# Altium project Nixie Valve Clock Power Supply Daughterboard.PrjPcb
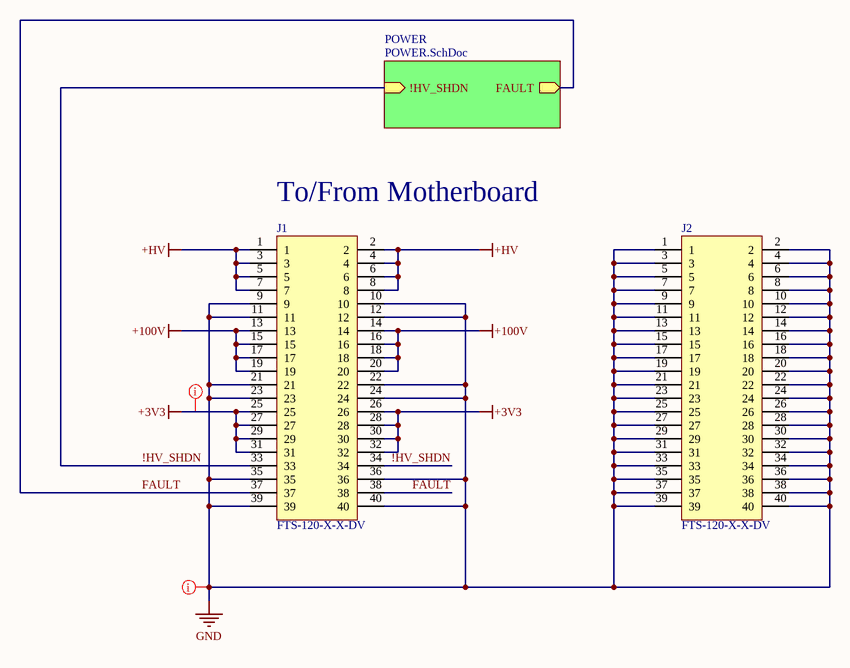
[diagram p0: Nixie Valve Clock Power Supply Daughterboard.SchDoc]
3 sheets, 48 parts. Net scope: hierarchical (ports join the sheet entries above them; power ports are global).
Board file: Nixie Valve Clock Power Supply Daughterboard.PcbDoc
Sheets:
  Nixie Valve Clock Power Supply Daughterboard.SchDoc
    POWER = POWER.SchDoc
      HV = HV.SchDoc

## Sheet Nixie Valve Clock Power Supply Daughterboard.SchDoc
size A4; SheetNumber: 1; SheetTotal: 3

### Parts
(Parts that share a designator on the sheet are numbered #1, #2 ... from top to bottom, then left to right.)
?#1  (no value)
J1  FTS-120-X-X-DV  [SAMTEC_FTS-120-X-X-DV]
J2  FTS-120-X-X-DV  [SAMTEC_FTS-120-X-X-DV]

### Sub-sheets
POWER = POWER.SchDoc: !HV_SHDN (in), FAULT (out)

### Nets
+3V3: J1.25 J1.26 J1.27 J1.28 J1.29 J1.30 J1.31 J1.32
+100V: J1.13 J1.14 J1.15 J1.16 J1.17 J1.18 J1.19 J1.20
+HV: J1.1 J1.2 J1.3 J1.4 J1.5 J1.6 J1.7 J1.8
GND: J1.9 J1.10 J1.11 J1.12 J1.21 J1.22 J1.23 J1.24 J1.35 J1.36 J1.39 J1.40 J2.1 J2.2 J2.3 J2.4 J2.5 J2.6 J2.7 J2.8 J2.9 J2.10 J2.11 J2.12 J2.13 J2.14 J2.15 J2.16 J2.17 J2.18 J2.19 J2.20 J2.21 J2.22 J2.23 J2.24 J2.25 J2.26 J2.27 J2.28 J2.29 J2.30 J2.31 J2.32 J2.33 J2.34 J2.35 J2.36 J2.37 J2.38 J2.39 J2.40
!HV_SHDN: J1.33 J1.34 ; sheet POWER/!HV_SHDN
FAULT: J1.37 J1.38 ; sheet POWER/FAULT

### Layout directives
net class POWER: +3V3, GND

### Notes on the sheet
- (near J1) To/From Motherboard
- Project:
- Designer:
- Sheet
- of
- Filename:

### Library data of the parts
?#1 = CMP-00003-4: The KETS Schematic Sheet Title Block
J1 J2 = CMP-002-00205-3: Pin Header, Board-to-Board, 1.27 mm, 2 Rows, 40 Contacts, Surface Mount, FTS Series; Manufacturer Lifecycle Status: PRODUCTION; Gender: Male; MP: FTS-120-02-L-DV; MF: Samtec; Current Rating: 1.75A; Pitch: 1.27mm; Number of Contacts: 40; Pins: 40; Design Item ID: FTS-120-X-X-DV; Case/Package: None; Mounting Technology: Surface Mount; Check_prices: https://www.snapeda.com/parts/FTS-120-04-G-DV-P/Samtec/view-part/?ref=eda; Source: FTS-120-X-X-DV.SchLib; Value: *; Component Type: Standard; Min Operating Temperature: -55°C; Max Operating Temperature: 125°C; SnapEDA_Link: https://www.snapeda.com/parts/FTS-120-04-G-DV-P/Samtec/view-part/?ref=snap; Termination: Solder; Lifecycle Status: Production; Housing Material: Polymer; Housing Color: Black; Number of Rows: 2; RoHS: Compliant; Contact Material: Bronze; Orientation: Straight; REACH SVHC: No; Depth: 3.42mm; Length: 25.4mm; Contact Plating: Gold

## Sheet POWER.SchDoc
size A4; SheetNumber: 2; SheetTotal: 3
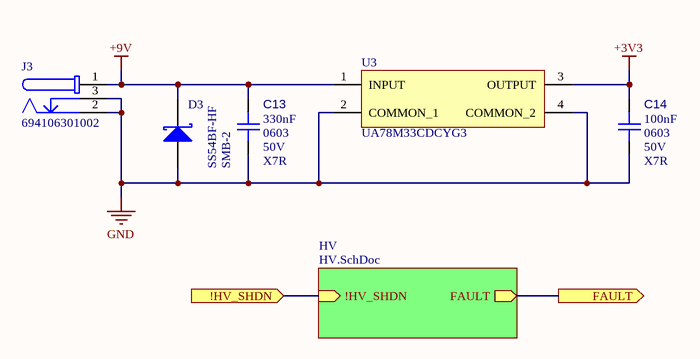
[diagram p1: POWER.SchDoc]

### Parts
(Parts that share a designator on the sheet are numbered #1, #2 ... from top to bottom, then left to right.)
?#2  (no value)
C13  value 330nF  Rated DC Voltage (URdc): 50V  Case/Package: 0603  Dielectric: X7R  [CAPC1608X10N]  (hidden comment: C1608X7R1H334K080AC)
C14  value 100nF  Voltage Rating: 50V  Case/Package: 0603  Dielectric: X7R  [CAPC1608X09N]  (hidden comment: CGA3E2X7R1H104K080AA)
D3  SS54BF-HF  Case/Package: SMB-2  [JCET-SMB-2_N]
J3  694106301002  [694106301002]
U3  UA78M33CDCYG3  [SOT-223-DB3_N]

### Sub-sheets
HV = HV.SchDoc: FAULT (out), !HV_SHDN (in)

### Ports
!HV_SHDN (in), FAULT (out)

### Nets
+3V3: C14.1 U3.3(OUTPUT)
+9V: C13.1 D3.2(K) J3.1 U3.1(INPUT)
GND: C13.2 C14.2 D3.1(A) J3.2 J3.3 U3.2(COMMON_1) U3.4(COMMON_2)
!HV_SHDN: port !HV_SHDN, sheet HV/!HV_SHDN
FAULT: port FAULT, sheet HV/FAULT

### Notes on the sheet
- Project:
- Designer:
- Sheet
- of
- Filename:

### Library data of the parts
?#2 = CMP-00003-4: The KETS Schematic Sheet Title Block
C13 = CMP-001-00114-1: Ceramic Capacitor, Multilayer, Ceramic, 50V, 10% +Tol, 10% -Tol, X7R, 15% TC, 0.33uF, Surface Mount, 0603; Multilayer: Yes; JESD-609 Code: e3; Width: 0.8mm; Voltage Rating: 50V; Tolerance  (fill in as +-): 10%; Packaging: Tape and Reel; Dielectric Material: Ceramic; Capacitor Type: Ceramic; Pins: 2; Package Shape: Rectangular; Reach SVHC Compliant: Yes; Package Style: SMTMeter; Min Operating Temperature: -55°C; Length: 1.6mm; Max Operating Temperature: 125°C; Terminal Finish: Nickel; Tolerance (fill in as +-): 10%; Termination: Wraparound; RoHS Compliant: Yes; Mounting Technology: Surface Mount; Temperature Characteristics Code: X7R; Tolerance: 10%; Height: 0.8mm
C14 = CMP-001-00101-1: Ceramic Capacitor, Multilayer, Ceramic, 50V, 10% +Tol, 10% -Tol, X7R, 15% TC, 0.1uF, Surface Mount, 0603; Reference Standard: AEC-Q200; Multilayer: Yes; Tolerance  (fill in as +-): 10%; Mounting Technology: Surface Mount; Max Operating Temperature: 125°C; Min Operating Temperature: -55°C; Tolerance: 10%; Packaging: Tape and Reel; Length: 1.6mm; Package Style: SMTMeter; Width: 0.8mm; Height: 0.8mm; Pins: 2; Reach SVHC Compliant: Yes; RoHS Compliant: Yes; Package Shape: Rectangular; Tolerance (fill in as +-): 10%; Rated DC Voltage (URdc): 50V; JESD-609 Code: e3; Capacitor Type: Ceramic; Termination: Wraparound; Terminal Finish: Nickel; Dielectric Material: Ceramic; Temperature Characteristics Code: X7R
D3 = CMP-004-00006-3: Rectifier Diode, Schottky, 1 Phase, 1 Element, 5A, 40V V(RRM), Silicon; Manufacturer: JCET; Forward Voltage: 550mV; Peak Reverse Current: 1mA; Max Forward Surge Current (Ifsm): 120A; Number of Elements: 1; Datasheet URL: http://wiki.seeedstudio.com/images/3/3f/0310130P1.pdf; Datasheet Version: May-13; Package Reference: SMB-2; RoHS Compliant: Unknown; Max Operating Temperature: 150°C; Min Operating Temperature: -55°C; Manufacturer URL: http://www.cj-elec.com/; Mounting Technology: SM; Package Description: 2-Pin Surface Mount Device, Body 4.315 x 3.62 mm; Number of Terminals: 2; REACH SVHC: Yes; Lifecycle Status: Production; Reverse Standoff Voltage: 40V; Max Output current: 5A; RoHS: Compliant
J3 = CMP-002-00210-1: DC Power Jack Connector WR-DC, Male, Right Angled, THT, 5 A, 24 V; Max Current Rating: 5A; Shielding: Unshielded; Operating Supply Voltage: 24V; Insulation Resistance: 100MΩ; Number of Contacts: 3; Color: Black; Gender: Male; Mounting Technology: Through Hole; Connector Type: Power; Flammability Rating: UL94 V-0; Housing Material: Polyamide; RoHS Compliant: Yes; Current Rating: 5A; Max Operating Temperature: 85°C; Voltage Rating: 24V; Pins: 3; Min Operating Temperature: -40°C; Contact Plating: Tin; Packaging: Bulk; Contact Gender: Female; REACH SVHC: Unknown; Termination: Through Hole; Height: 11mm; RoHS: Compliant; Contact Material: Gold, Tin
U3 = CMP-00395-1: Standard Regulator Pos 3.3V 0.5A 4-Pin(3+Tab) SOT-223 Tube; Manufacturer Lifecycle Status: ACTIVE; Quiescent Current: 4.5mA; Dropout Voltage: 2V; Power Supply Rejection Ratio (PSRR): 80dB; Polarity: Positive; Number of Outputs: 1; Max Output current: 500mA; Min Input Voltage: 5.3V; Max Supply Voltage: 25V; Output Type: Fixed; Width: 3.5mm; Radiation Hardening: No; Lifecycle Status: Production; Min Operating Temperature: -40°C; Thickness: 1.6mm; Height: 1.8mm; Number of Regulators: 1; Output Current: 500mA; Case/Package: SOT-223; Max Operating Temperature: 125°C; Lead Free: Lead Free; Output Voltage: 3.3V; Length: 6.5mm; Packaging: Rail/Tube; Pins: 4; RoHS: Compliant; Mounting Technology: Surface Mount

## Sheet HV.SchDoc
size A2; SheetNumber: 3; SheetTotal: 3
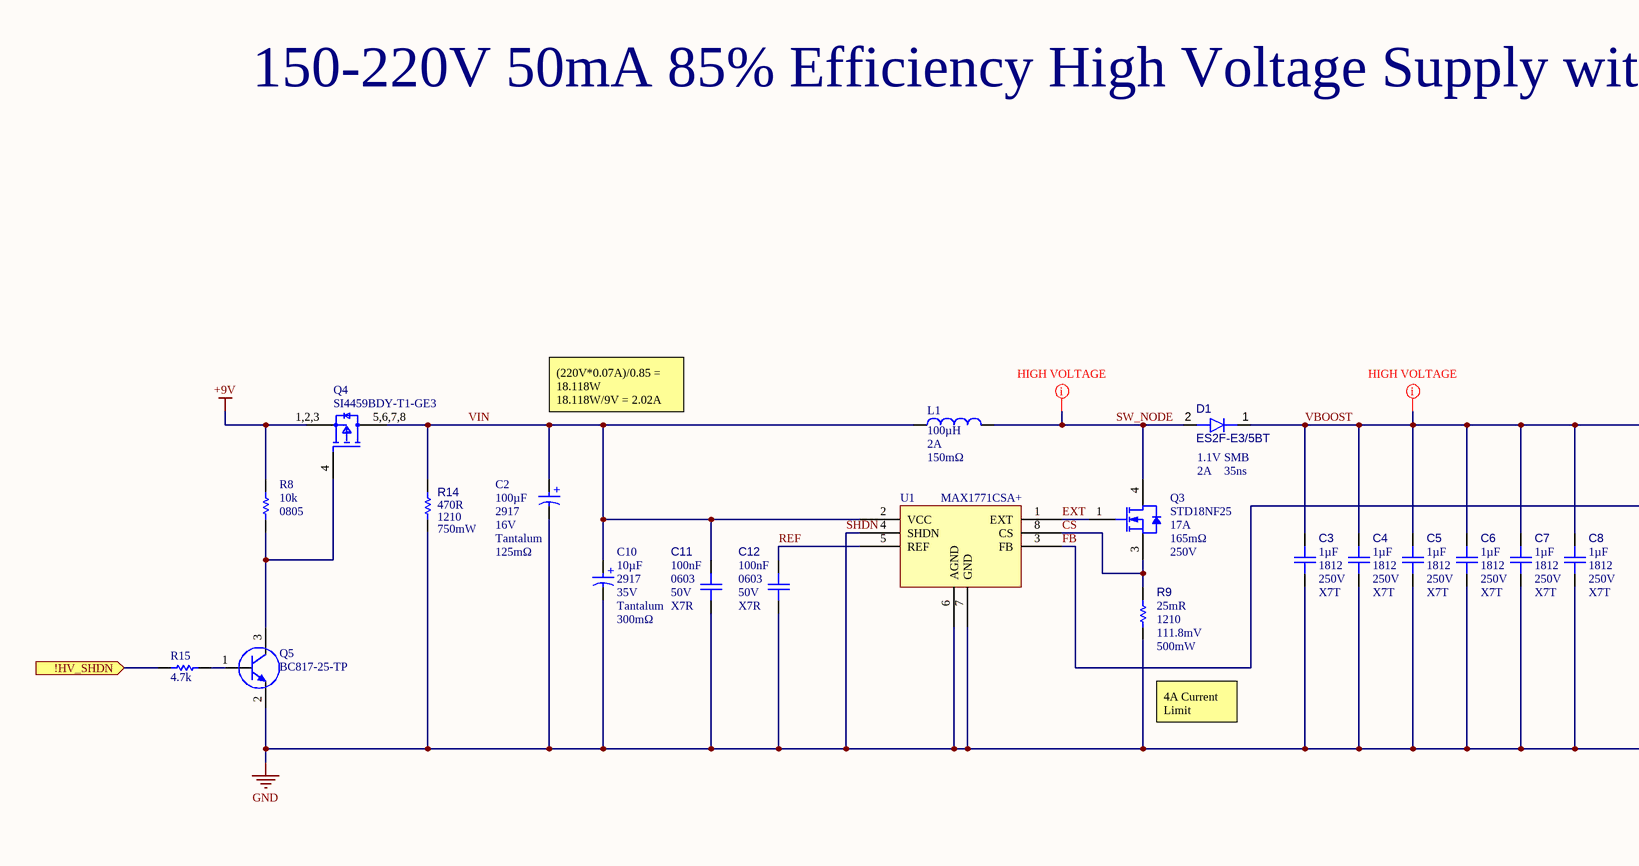
[diagram p2: HV.SchDoc, left]
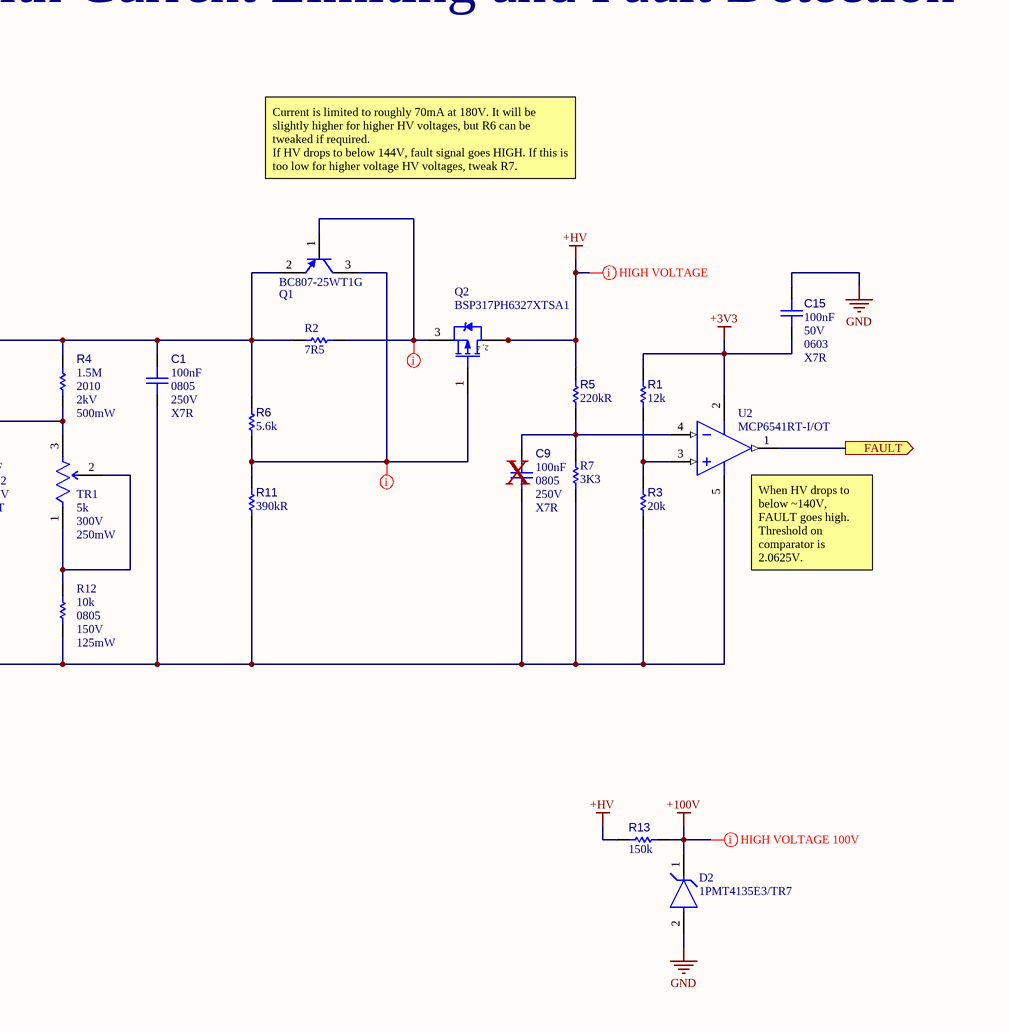
[diagram p3: HV.SchDoc, right]

### Parts
(Parts that share a designator on the sheet are numbered #1, #2 ... from top to bottom, then left to right.)
?#3  (no value)
C1  value 100nF  Voltage Rating: 250V  Dielectric: X7R  Case/Package: 0805  [CAPC2013X95X50NL10T25-Wider-Spacing]  (hidden comment: CC0805KKX7RYBB104)
C2  value 100µF  Case/Package: 2917  Dielectric Material: Tantalum  ESR (Equivalent Series Resistance): 125mΩ  Voltage: 16V  [CAPMP7344X31N]  (hidden comment: TPSD107M016R0125)
C3  value 1µF  Dielectric: X7T  Case Code (Imperial): 1812  Voltage Rating (DC): 250V  [CAPC4532X28N]  (hidden comment: CGA8P3X7T2E105K250KA)
C4  value 1µF  Dielectric: X7T  Case Code (Imperial): 1812  Voltage Rating (DC): 250V  [CAPC4532X28N]  (hidden comment: CGA8P3X7T2E105K250KA)
C5  value 1µF  Dielectric: X7T  Case Code (Imperial): 1812  Voltage Rating (DC): 250V  [CAPC4532X28N]  (hidden comment: CGA8P3X7T2E105K250KA)
C6  value 1µF  Dielectric: X7T  Case Code (Imperial): 1812  Voltage Rating (DC): 250V  [CAPC4532X28N]  (hidden comment: CGA8P3X7T2E105K250KA)
C7  value 1µF  Dielectric: X7T  Case Code (Imperial): 1812  Voltage Rating (DC): 250V  [CAPC4532X28N]  (hidden comment: CGA8P3X7T2E105K250KA)
C8  value 1µF  Dielectric: X7T  Case Code (Imperial): 1812  Voltage Rating (DC): 250V  [CAPC4532X28N]  (hidden comment: CGA8P3X7T2E105K250KA)
C9  value 100nF  Voltage Rating: 250V  Dielectric: X7R  Case/Package: 0805  [CAPC2013X95X50NL10T25]  (hidden comment: CC0805KKX7RYBB104)
C10  value 10µF  Voltage Rating: 35V  Case/Package: 2917  Capacitor Type: Tantalum  ESR (Equivalent Series Resistance): 300mΩ  [CAPMP7344X31N]  (hidden comment: TPSD106K035R0300)
C11  value 100nF  Voltage Rating: 50V  Case/Package: 0603  Dielectric: X7R  [CAPC1608X09N]  (hidden comment: CGA3E2X7R1H104K080AA)
C12  value 100nF  Voltage Rating: 50V  Case/Package: 0603  Dielectric: X7R  [CAPC1608X09N]  (hidden comment: CGA3E2X7R1H104K080AA)
C15  value 100nF  Voltage Rating: 50V  Case/Package: 0603  Dielectric: X7R  [CAPC1608X09N]  (hidden comment: CGA3E2X7R1H104K080AA)
D1  ES2F-E3/5BT  Recovery Time: 35ns  Max Output current: 2A  Forward Voltage: 1.1V  Case/Package: SMB  [DIOM4336X24N]
D2  1PMT4135E3/TR7  [FP-DO-216-MFG]
L1  value 100µH  DC Resistance (DCR): 150mΩ  Saturation Current: 2A  [BOUR-SRR1280-2_V]  (hidden comment: SRR1280-101M)
Q1  BC807-25WT1G  [ONSC-SC-70-3-419-04_V]
Q2  BSP317PH6327XTSA1  [INF-PG-SOT223_SC-73_N]
Q3  STD18NF25  Continuous Drain Current (ID): 17A  Rds On Max: 165mΩ  Drain to Source Voltage (Vdss): 250V  [DPAK229P972X240-3N]
Q4  SI4459BDY-T1-GE3  [SI4459BDY-T1-GE3-Footprint-1]
Q5  BC817-25-TP  [SOT95P237X110-3N]
R1  value 12k  [RESC1609X55X30NL15T15]  (hidden comment: ERJ3EKF1202V)
R2  value 7R5  [RESC1608X55X25NL10T15]  (hidden comment: AC0603FR-077R5L)
R3  value 20k  [RESC1608X55X30NL15T15]  (hidden comment: ERJ3EKF2002V)
R4  value 1.5M  Power Dissipation: 500mW  Working Voltage: 2kV  Case/Package: 2010  [RESC5125X07N]  (hidden comment: CRMA2010AF1M50FKEF)
R5  value 220kR  [RESC5125X07N]  (hidden comment: 5-2176330-3)
R6  value 5.6k  [RESC1609X55X30NL15T15]  (hidden comment: ERJ-3EKF5601V)
R7  value 3K3  [RESC1608X55X25NL10T15]  (hidden comment: ERJ-3RBD3301V)
R8  value 10k  Case/Package: 0805  [RESC2013X50X35NL15T15]  (hidden comment: Resistor 10k +/-1% 0805 125 mW)
R9  value 25mR  Case/Package: 1210  Power Dissipation: 500mW  Working Voltage: 111.8mV  [RESC3126X65X50NL10T20]  (hidden comment: RL1210FR-070R025L)
R11  value 390kR  [RESC5125X07N]  (hidden comment: 5-2176347-6)
R12  value 10k  Power: 125mW  Case/Package: 0805  Voltage Rating: 150V  [RESC2013X50X35NL15T15]  (hidden comment: Resistor 10k +/-1% 0805 125 mW)
R13  value 150k  [RESC3216X06N]  (hidden comment: CRCW1206150KFKEA)
R14  value 470R  Power Dissipation: 750mW  Case Code (Imperial): 1210  [RESC3126X65X50NL10T20]  (hidden comment: CRCW1210470RFKEAHP)
R15  value 4.7k  [RESC1608X55X25NL10T15]  (hidden comment: Resistor 4k7 +/-1% 0603 100 mW)
TR1  value 5k  Voltage Rating: 300V  Power: 250mW  [3266W-1-502LF-Footprint-1]  (hidden comment: 3266W-1-502LF)
U1  MAX1771CSA+  [Copy of ADI-R-8_N]
U2  MCP6541RT-I/OT  [SOT-23-OT5_N]

### Ports
!HV_SHDN (in), FAULT (out)

### Nets
+3V3: C15.1 R1.2 U2.2(VDD)
+9V: Q4.1,2,3(S) R8.2
+100V: D2.1(C) R13.2
+HV: Q2.2(DRAIN) Q2.4(DRAIN) R5.2 R13.1
GND: C1.2 C2.2(N) C3.2 C4.2 C5.2 C6.2 C7.2 C8.2 C9.2 C10.2(N) C11.2 C12.2 C15.2 D2.2(A) Q5.2(E) R3.1 R7.1 R9.1 R11.1 R12.1 R14.1 U1.4(SHDN) U1.6(AGND) U1.7(GND) U2.5(VSS)  [also labelled SHDN]
!HV_SHDN: R15.2 ; port !HV_SHDN
CS: Q3.3(S) R9.2 U1.8(CS)
EXT: Q3.1(G) U1.1(EXT)
FAULT: U2.1(OUT) ; port FAULT
FB: R4.1 TR1.3(CW) U1.3(FB)
REF: C12.1 U1.5(REF)
SW_NODE: D1.2(A) L1.2 Q3.4(D)
VBOOST: C1.1 C3.1 C4.1 C5.1 C6.1 C7.1 C8.1 D1.1(K) Q1.2(E) R2.1 R4.2 R6.2
VIN: C2.1(P) C10.1(P) C11.1 L1.1 Q4.5,6,7,8(D) R14.2 U1.2(VCC)
NetC9_1: C9.1 R5.1 R7.2 U2.4(VIN-)
NetQ1_1: Q1.1(B) Q2.3(SOURCE) R2.2
NetQ1_3: Q1.3(C) Q2.1(GATE) R6.1 R11.2
NetQ4_4: Q4.4(G) Q5.3(C) R8.1
NetQ5_1: Q5.1(B) R15.1
NetR1_1: R1.1 R3.2 U2.3(VIN+)
NetR12_2: R12.2 TR1.1(CCW) TR1.2(WIPER)

### Layout directives
net class HIGH VOLTAGE 100V: +100V
net class HIGH VOLTAGE: +HV, NetQ1_1, NetQ1_3, SW_NODE, VBOOST

### Notes on the sheet
- 150-220V 50mA 85% Efficiency High Voltage Supply with Current Limiting and Fault Detection
- Current is limited to roughly 70mA at 180V. It will be slightly higher for higher HV voltages, but R6 can be tweaked if required.
  If HV drops to below 144V, fault signal goes HIGH. If this is too low for higher voltage HV voltages, tweak R7.
- (220V*0.07A)/0.85 = 18.118W
  18.118W/9V = 2.02A
- (near C9) X
- (near U2) When HV drops to below ~140V, FAULT goes high. Threshold on comparator is 2.0625V.
- 4A Current Limit
- Designer:
- Project:
- Filename:
- Sheet
- of
- (in symbol CMP-001-00157-2) +
- (in symbol CMP-001-00158-1) +
- (in symbol CMP-013-00065-1) 2, 4

### Library data of the parts
?#3 = CMP-00003-4: The KETS Schematic Sheet Title Block
C1 C9 = CMP-00390-2: Ceramic Capacitor, Ceramic, 250V, 10% +Tol, 10% -Tol, X7R, 15% TC, 0.1uF, Surface Mount, 0805; Dielectric Material: Ceramic; RoHS Compliant: Yes; China RoHS: Compliant; Mounting Technology: Surface Mount; Lifecycle Status: Production; Pins: 2; Min Operating Temperature: -55°C; Max Operating Temperature: 125°C; Voltage Rating (DC): 250V; Material: Ceramic; Width: 1.25mm; Tolerance: 10%; Number of Terminals: 2; Length: 2mm; Height: 1.25mm; REACH SVHC: Yes; RoHS: Compliant
C2 = CMP-001-00157-2: Cap Tant Solid 100uF 16V D CASE 20% (7.3 X 4.3 X 2.9mm) SMD 7343-31 0.125 Ohm 125AHA T/R; Ripple Current: 438mA; Capacitor Type: Tantalum Capacitor; Dissipation Factor: 6%; Polarity: Polar; Leakage Current: 16µA; Mounting Technology: Surface Mount; China RoHS: Compliant; Radiation Hardening: No; Lifecycle Status: Production; Case Code (Imperial): 2917; Depth: 4.3mm; RoHS Compliant: Yes; Lead Free: Lead Free; Case Code (Metric): 7343; Lead Pitch: 4.4mm; Number of Terminals: 2; Pins: 2; Voltage Rating: 16V; Voltage Rating (DC): 16V; Width: 4.3mm; Dielectric: Tantalum; Length: 7.3mm; REACH SVHC: Yes; Height - Seated (Max): 3.0988mm; Schedule B: 8532210050; Features: General Purpose; Termination: SMD/SMT; Min Operating Temperature: -55°C; Tolerance: 20%; Max Operating Temperature: 125°C; Height: 2.9mm; RoHS: Compliant
C3-C8 = CMP-001-00159-1: CGA Series 1812 1 uF 250 V ±10 % Tolerance X7T SMT Multilayer Ceramic Capacitor; Manufacturer Lifecycle Status: PRODUCTION; Capacitor Type: MLCC; Tolerance: 10%; Min Length: 4.1mm; Weight: 26.988746mg; Max Length: 4.9mm; Schedule B: 8532240020, 8532240020; Composition: Ceramic; Thickness: 2.4892mm; Width: 3.2mm; Voltage Rating: 250V; RoHS Compliant: Yes; Dielectric Material: Ceramic; Material: Ceramic; Max Operating Temperature: 125°C; Length: 4.5mm; Pins: 2; Min Width: 2.8mm; Number of Terminals: 2; Termination: SMD/SMT; Ratings: AEC-Q200; Lifecycle Status: Production; RoHS: Compliant; Mounting Technology: Surface Mount; Min Operating Temperature: -55°C; China RoHS: Compliant; Height: 2.5mm; Max Width: 3.6mm; Case/Package: 1812; REACH SVHC: Yes; Case Code (Metric): 4532; Depth: 3.2mm
C10 = CMP-001-00158-1: Capacitor Tantalum Solid 10uF 35V D CASE 10% (7.3 X 4.3 X 2.9mm) SMD 7343-31 0.3 Ohm 125C T/R; Dissipation Factor: 6%; Leakage Current: 3.5µA; Ripple Current: 283mA; Polarity: Polar; Approvals: IEC; Pins: 2; Schedule B: 8532210050, 8532210050; Weight: 670.01263mg; Mounting Technology: Surface Mount; Min Operating Temperature: -55°C; China RoHS: Compliant; REACH SVHC: Yes; Depth: 4.3mm; Voltage Rating (AC): 35V; Tolerance: 10%; Case Code (Imperial): 2917; Case Code (Metric): 7343; Features: General Purpose; Length: 7.3mm; Termination: SMD/SMT; Width: 4.3mm; Dielectric Material: Tantalum; Voltage: 35V; Lifecycle Status: Production; Lead Free: Lead Free; Number of Terminals: 2; Voltage Rating (DC): 35V; Packaging: Cut Tape; Height - Seated (Max): 3.0988mm; Height: 2.9mm; Radiation Hardening: No; Dielectric: Tantalum; Max Operating Temperature: 125°C; RoHS: Compliant
C11 C12 C15 = CMP-001-00101-1: as C14 on sheet POWER; Tolerance  (fill in as +-): 10%; Mounting Technology: Surface Mount; Max Operating Temperature: 125°C; Min Operating Temperature: -55°C; Tolerance: 10%; Packaging: Tape and Reel; Length: 1.6mm; Package Style: SMTMeter; Width: 0.8mm; Height: 0.8mm; Pins: 2; Reach SVHC Compliant: Yes; RoHS Compliant: Yes; Package Shape: Rectangular; Tolerance (fill in as +-): 10%; Rated DC Voltage (URdc): 50V; JESD-609 Code: e3; Capacitor Type: Ceramic; Termination: Wraparound; Terminal Finish: Nickel; Dielectric Material: Ceramic; Temperature Characteristics Code: X7R
D1 = CMP-004-00061-1: Rectifier Diode, 1 Phase, 1 Element, 2A, 300V V(RRM), Silicon, DO-214AA; Peak Reverse Current: 10µA; Element Configuration: Single; Reverse Recovery Time: 50ns; Max Forward Surge Current (Ifsm): 50A; Number of Elements: 1; Average Rectified Current: 2A; China RoHS: Non-Compliant; RoHS Compliant: Yes; Pins: 2; Lifecycle Status: Production; Number of Terminals: 2; Forward Current: 2A; Radiation Hardening: No; RoHS: Compliant; Peak Non-Repetitive Surge Current: 50A; Min Operating Temperature: -55°C; Max Surge Current: 50A; Max Operating Temperature: 150°C; Reverse Voltage: 300V; Mounting Technology: Surface Mount; Max Repetitive Reverse Voltage (Vrrm): 300V; REACH SVHC: No; Max Reverse Voltage (DC): 300V; Reverse Standoff Voltage: 300V
D2 = CMP-004-00063-1: Diode Zener Single 100V 5% 1W 2-Pin(1+Tab) Power Mite T/R; Impedance: 250Ω; Max Junction Temperature (Tj): 150°C; Max Reverse Leakage Current: 10nA; Reverse Voltage: 76V; Forward Voltage: 1.1V; Max Operating Temperature: 150°C; Mounting Technology: Surface Mount; Country of Origin: PHL; Power Dissipation: 1W; Export Control Classification Number (ECCN) Code: EAR99; RoHS: Compliant; Min Operating Temperature: -55°C; Length: 2.03mm; Projected EOL Date: 2049-02-02; Contact Plating: Tin; Max Power Dissipation: 1W; Tolerance: 5%; Voltage Tolerance: 5%; Height: 1.14mm; Lifecycle Status: Production; Case/Package: DO-216-2; Country of Assembly: Philippines; Peak Reverse Current: 10nA; Zener Current: 10nA; Country of Fabrication: Taiwan; Element Configuration: Single; Packaging: Tape & Reel (TR); Zener Voltage: 100V; Harmonized Tariff Schedule (HTS) Code: 8541.10.0050
L1 = CMP-006-00066-1: Inductor Power Shielded Wirewound 100uH 20% 1KHz 18Q-Factor Ferrite 2.1A 0.15Ohm DCR T/R; Q Factor: 18; Material: Steel; Shielding: Yes; Number of Circuits: 1; Frequency: 4.5MHz; Composition: Wirewound; Military Standard: Not; RoHS Compliant: Yes; Radiation Hardening: No; Contact Plating: Tin; RMS Current (Irms): 2.1A; Lifecycle Status: Production; Width: 12.5mm; Tolerance: 20%; Packaging: Tape & Reel; Inductance Tolerance: 20%; Depth: 12.8mm; RoHS: Compliant; Core Material: Ferrite; Mounting Technology: Surface Mount; Current Rating: 2.1A; Length: 12.5mm; Test Frequency: 1kHz; Max Current Rating: 2.1A; China RoHS: Compliant; Max Operating Temperature: 125°C; Number of Terminals: 2; DC Current: 2.1A; Schedule B: 8504500000, 8504500000; Termination: SMD/SMT; Self Resonant Frequency: 4.5MHz; Height - Seated (Max): 8.001mm; Max DC Current: 2.1A; Case/Package: Nonstandard; Min Operating Temperature: -40°C; Height: 7.5mm; REACH SVHC: Yes
Q1 = CMP-013-00064-1: Small Signal Bipolar Transistor, 0.5A I(C), 45V V(BR)CEO, 1-Element, PNP, Silicon; Manufacturer Lifecycle Status: ACTIVE; Frequency: 100MHz; Collector Base Voltage (VCBO): 50V; Collector Emitter Saturation Voltage: -700mV; Element Configuration: Single; Number of Elements: 1; Max Power Dissipation: 460mW; Max Collector Current: 500mA; Emitter Base Voltage (VEBO): 5V; hFE Min: 160; Max Operating Temperature: 150°C; Clock Frequency: 100MHz; Halogen Free: Halogen Free; Number of Terminals: 3; REACH SVHC: Yes; Radiation Hardening: No; Polarity: PNP; Pins: 3; Transition Frequency: 100MHz; Lead Free: Lead Free; RoHS: Compliant; Width: 1.35mm; Max Breakdown Voltage: 45V; Collector Emitter Voltage (VCEO): 45V; Case/Package: SC; Packaging: Tape and Reel; Power Dissipation: 460mW; Lifecycle Status: Production; Height: 900µm; Collector Emitter Breakdown Voltage: 45V; Schedule B: 8541210080, 8541210080; Min Operating Temperature: -55°C; Contact Plating: Tin; China RoHS: Compliant; Length: 2.2mm
Q2 = CMP-013-00065-1: MOSFET P-CH 250V 430MA SOT223-4 P-Channel 250 V 430mA (Ta) 1.8W (Ta) Surface Mount PG-SOT223-4; Turn-Off Delay Time: 254ns; Rise Time: 11.1ns; Max Dual Supply Voltage: -250V; Turn-On Delay Time: 5.7ns; Gate to Source Voltage (Vgs): 20V; Rds On Max: 4Ω; Element Configuration: Single; Nominal Vgs: 2V; Fall Time: 67ns; Input Capacitance: 210pF; Number of Elements: 1; Max Operating Temperature: 150°C; China RoHS: Compliant; Packaging: Tape & Reel; REACH SVHC: Yes; Min Operating Temperature: -55°C; Schedule B: 8541290080, 8541290080; RoHS Compliant: Yes; Width: 3.5mm; Drain to Source Resistance: 4Ω; Continuous Drain Current (ID): 430mA; Drain to Source Breakdown Voltage: -250V; Mounting Technology: Surface Mount; Length: 6.5mm; Lead Free: Lead Free; Case/Package: SOT-223; Power: 1.8W; On-State Resistance: 4Ω; Max Power Dissipation: 1.8W; Height: 1.6mm; Transistor Type: MOSFET; Lifecycle Status: Production; Pins: 4; Number of Terminals: 4; RoHS: Compliant; Min Breakdown Voltage: 250V; Package Quantity: 1000; Halogen Free: Halogen Free; Power Dissipation: 1.8W; Drain to Source Voltage (Vdss): -250V
Q3 = CMP-013-00061-1: N-Channel 250 V 0.165 Ohm Surface Mount STripFet II Power MosFet - TO-252-3; pin to pad: 2, 4>4; Turn-On Delay Time: 8.8ns; Rise Time: 17.2ns; Power Dissipation: 110W; Number of Elements: 1; Gate to Source Voltage (Vgs): 20V; Turn-Off Delay Time: 21ns; Input Capacitance: 1nF; Packaging: Tape and Reel; Mounting Technology: Surface Mount; Min Operating Temperature: -55°C; Drain to Source Resistance: 165mΩ; REACH SVHC: No; Radiation Hardening: No; Schedule B: 8541290080; Number of Terminals: 2; Lifecycle Status: Production; Min Breakdown Voltage: 250V; Lead Free: Lead Free; Case/Package: DPAK; China RoHS: Non-Compliant; RoHS: Compliant; Max Power Dissipation: 110W; Pins: 3; Max Operating Temperature: 175°C; Fall Time: 8.8ns
Q4 = CMP-013-00066-1: Transistor MOSFET P-CH 30V 27.8A 8-Pin SOIC; Drain to Source Resistance: 4.9mΩ; Number of Elements: 1; Max Power Dissipation: 5.6W; Schedule B: 8541290080, 8541290080; Number of Terminals: 8; Min Operating Temperature: -55°C; Lifecycle Status: Production; RoHS: Compliant; REACH SVHC: Yes; Min Breakdown Voltage: 30V; Max Operating Temperature: 150°C; Continuous Drain Current (ID): 27.8A
Q5 = CMP-013-00044-4: Small Signal Bipolar Transistor, 0.5A I(C), 45V V(BR)CEO, 1-Element, NPN, Silicon; Power: 300mW; Transistor Type: BJT; Frequency: 100MHz; Max Operating Temperature: 150°C; Case/Package: SOT-23-3; RoHS Compliant: Yes; Pins: 3; Mounting Technology: SMD/SMT; Min Operating Temperature: -55°C
R1 = CMP-009-00230-1: Fixed Resistor, Metal Glaze/thick Film, 0.1W, 12000ohm, 75V, 1% +/-Tol, 100ppm/Cel, Surface Mount, 0603; Package Length: 1.6mm; Power: 100mW; Package Width: 0.8mm; Package Height: 0.45mm; Rated Temperature: 70°C; Reference Standard: AEC-Q200; Temperature Coefficient: 100ppm/°C; Reach SVHC Compliant: Yes; Termination: Wraparound; Max Operating Temperature: 155°C; Working Voltage: 75V; JESD-609 Code: e3; Case/Package: 0603; Mounting Technology: Surface Mount; Pins: 2; Min Operating Temperature: -55°C; Voltage Rating: 75V; Technology: METAL GLAZE/THICK FILM; Tolerance: 1%; Terminal Finish: Nickel; RoHS Compliant: Yes; Construction: Rectangular; Package Style: SMTMeter; Resistor Type: FIXED RESISTOR; Package Shape: Rectangular; Packaging: Tape and Reel
R2 = CMP-00401-2: Res Thick Film 0603 7.5 Ohm 1% 0.1W(1/10W) ±200ppm/C Pad SMD T/R Automotive AEC-Q200; Power: 100mW; Voltage Rating: 75V; Temperature Coefficient: 200ppm/°C; Mounting Technology: Surface Mount; Tolerance: 1%; Height: 450µm; Number of Terminals: 2; Max Operating Temperature: 155°C; Termination: SMD/SMT; Length: 1.6002mm; Lifecycle Status: Production; Pins: 2; Power Dissipation: 100mW; China RoHS: Non-Compliant; Composition: Thick Film; Width: 800µm; RoHS Compliant: Yes; Case Code (Metric): 1608; Case Code (Imperial): 0603; RoHS: Compliant; REACH SVHC: Yes; Case/Package: 0603; Number of Terminations: 2; Packaging: Tape & Reel; Power Rating: 100mW; Working Voltage: 75V; Min Operating Temperature: -55°C; Features: Automotive AEC-Q200, Moisture Resistant; Max Power Dissipation: 100mW
R3 = CMP-009-00244-1: Fixed Resistor, Metal Glaze/thick Film, 0.1W, 20000ohm, 75V, 1% +/-Tol, 100ppm/Cel, Surface Mount, 0603; Power: 100mW; Package Width: 0.8mm; Reference Standard: AEC-Q200; Temperature Coefficient: 100ppm/°C; Package Height: 0.45mm; Package Length: 1.6mm; Rated Temperature: 70°C; Resistor Type: FIXED RESISTOR; Construction: Rectangular; Reach SVHC Compliant: Yes; Package Shape: Rectangular; Voltage Rating: 75V; Tolerance: 1%; Termination: Wraparound; Working Voltage: 75V; Packaging: Tape and Reel; Technology: METAL GLAZE/THICK FILM; Max Operating Temperature: 155°C; RoHS Compliant: Yes; Package Style: SMTMeter; Terminal Finish: Nickel; Min Operating Temperature: -55°C; Mounting Technology: Surface Mount; JESD-609 Code: e3; Case/Package: 0603; Pins: 2
R4 = CMP-009-00356-2: Fixed Resistor, Metal Glaze/thick Film, 0.5W, 1.5e+06ohm, 2000V, 1% +/-Tol, 100ppm/Cel, Surface Mount, 2010; Temperature Coefficient: 100ppm/°C; Tolerance: 1%; Min Operating Temperature: -55°C; Height: 640µm; Max Operating Temperature: 155°C; Lifecycle Status: Production; Width: 2.54mm; RoHS: Compliant; Number of Terminals: 2; Mounting Technology: Surface Mount
R5 = CMP-00408-2: Fixed Resistor, Thick Film, 1.25W, 220000ohm, 400V, 1% +/-Tol, 100ppm/Cel, Surface Mount, 2010; Temperature Coefficient: 100ppm/°C; Tolerance: 1%; Voltage Rating: 400V; REACH SVHC: Yes; Power Dissipation: 1.25W; Number of Terminals: 2; Width: 2.5mm; Height: 550µm; Min Operating Temperature: -55°C; Ambient Temperature Range High: 70°C; China RoHS: Non-Compliant; Operating Supply Voltage: 400V; Packaging: Cut Tape; Case/Package: 2010; Lifecycle Status: Production; Power: 1.25W; Composition: Thick Film; Max Operating Temperature: 155°C; Working Voltage: 400V; Mounting Technology: Surface Mount; Power Rating: 1.25W; Voltage Rating (DC): 400V; Pins: 2; RoHS: Compliant
R6 = CMP-009-00257-2: Fixed Resistor, Metal Glaze/thick Film, 0.1W, 5600ohm, 75V, 1% +/-Tol, 100ppm/Cel, Surface Mount, 0603; Rated Temperature: 70°C; Package Width: 0.8mm; Power: 100mW; Reference Standard: AEC-Q200; Package Length: 1.6mm; Temperature Coefficient: 100ppm/°C; Package Height: 0.45mm; Voltage Rating: 75V; Mounting Technology: Surface Mount; Construction: Rectangular; Working Voltage: 75V; Resistor Type: FIXED RESISTOR; Reach SVHC Compliant: Yes; Terminal Finish: Nickel; Tolerance: 1%; Technology: METAL GLAZE/THICK FILM; Min Operating Temperature: -55°C; Termination: Wraparound; Max Operating Temperature: 155°C; Packaging: Tape and Reel; Package Style: SMTMeter; JESD-609 Code: e3; Package Shape: Rectangular; Pins: 2; Case/Package: 0603; RoHS Compliant: Yes
R7 = CMP-00199-2: Fixed Resistor, Metal Glaze/thick Film, 0.1W, 3300ohm, 75V, 0.5% +/-Tol, 50ppm/Cel, Surface Mount, 0603; Power: 100mW; Working Voltage: 50V; Rated Temperature: 70°C; RoHS Compliant: Yes; Max Operating Temperature: 125°C; Mounting Technology: Surface Mount; Pins: 2; Voltage Rating: 75V; Min Operating Temperature: -55°C; Tolerance: 0.5%; Case/Package: 0603
R8 = CMP-009-00018-11: Chip Resistor, 10 KOhm, +/- 1%, 125 mW, -55 to 155 degC, 0805 (2012 Metric); Power: 125mW; Voltage Rating: 150V; Max Operating Temperature: 155°C; RoHS Compliant: True; Mounting Technology: SM; Pins: 2; Tolerance: 1%; Min Operating Temperature: -55°C
R9 = CMP-00400-2: Fixed Resistor, Metal Glaze/thick Film, 0.5W, 0.025ohm, 0.1118V, 1% +/-Tol, 1000ppm/Cel, Surface Mount, 1210; Temperature Coefficient: 1000ppm/°C; Number of Terminations: 2; Lead Free: Lead Free; Composition: Thick Film; Pins: 2; Min Operating Temperature: -55°C; Max Power Dissipation: 500mW; Number of Terminals: 2; Width: 2.6mm; Lifecycle Status: Production; Power: 500mW; Length: 3.0988mm; Power Rating: 500mW; China RoHS: Non-Compliant; Height: 550µm; Max Operating Temperature: 155°C; Features: Moisture Resistant; Mounting Technology: Surface Mount; Tolerance: 1%; REACH SVHC: Yes; RoHS: Compliant; Voltage Rating: 111.8mV
R11 = CMP-00393-1: Res Thick Film 2010 390K Ohm 1% 0.75W(3/4W) ±100ppm/C Pad SMD Automotive T/R; Temperature Coefficient: 100ppm/°C; Working Voltage: 200V; Power Dissipation: 750mW; Pins: 2; Packaging: Cut Tape; Voltage Rating: 200V; Width: 2.5mm; Ambient Temperature Range High: 70°C; Number of Terminals: 2; Lifecycle Status: Production; Operating Supply Voltage: 200V; Tolerance: 1%; Composition: Thick Film; Height: 550µm; Min Operating Temperature: -55°C; RoHS: Compliant; Case/Package: 2010; Max Operating Temperature: 155°C; China RoHS: Non-Compliant; Voltage Rating (DC): 200V; Schedule B: 8533210025; Mounting Technology: Surface Mount; REACH SVHC: Yes; Power Rating: 750mW
R12 = CMP-009-00018-11: Chip Resistor, 10 KOhm, +/- 1%, 125 mW, -55 to 155 degC, 0805 (2012 Metric); Max Operating Temperature: 155°C; RoHS Compliant: True; Mounting Technology: SM; Pins: 2; Tolerance: 1%; Min Operating Temperature: -55°C
R13 = CMP-009-00239-1: Fixed Resistor, Metal Glaze/thick Film, 0.25W, 150000ohm, 200V, 1% +/-Tol, 100ppm/Cel, Surface Mount, 1206; Rated Temperature: 70°C; Reference Standard: AEC-Q200; Package Height: 0.55mm; Package Width: 1.6mm; Package Length: 3.2mm; Temperature Coefficient: 100ppm/°C; Power: 250mW; Additional Feature: RATED AC VOLTAGE (V): 200; Reach SVHC Compliant: Yes; Termination: Wraparound; Tolerance: 1%; JESD-609 Code: e3; Package Style: SMTMeter; Min Operating Temperature: -55°C; Terminal Finish: Nickel; Working Voltage: 200V; Package Shape: Rectangular; Case/Package: 1206; Mounting Technology: Surface Mount; Packaging: Tape and Reel; Max Operating Temperature: 155°C; RoHS Compliant: Yes; Construction: Chip; Resistor Type: FIXED RESISTOR; Technology: METAL GLAZE/THICK FILM; Pins: 2
R14 = CMP-00406-2: Res Thick Film 1210 470 Ohm 1% 0.75W(3/4W) ±100ppm/C Pad SMD Automotive T/R; Working Voltage: 200V; Temperature Coefficient: 100ppm/°C; Lifecycle Status: Production; Composition: Thick Film; Lead Free: Lead Free; Case Code (Metric): 3225; Max Operating Temperature: 155°C; Number of Terminations: 2; REACH SVHC: Yes; Mounting Technology: Surface Mount; Max Power Dissipation: 750mW; Power Rating: 750mW; Weight: 18.001947mg; Pins: 2; Width: 2.5mm; Voltage Rating: 200V; Power: 750mW; China RoHS: Non-Compliant; Height: 600µm; Features: Automotive AEC-Q200; Case/Package: 1210; RoHS: Compliant; Number of Terminals: 2; Min Operating Temperature: -55°C; Tolerance: 1%; Length: 3.2004mm
R15 = CMP-009-00031-13: Chip Resistor, 4.7 KOhm, +/- 1%, 0.1 W, -55 to 155 degC, 0603 (1608 Metric); Power: 100mW; Pins: 2; Min Operating Temperature: -55°C; Mounting Technology: SM; Max Operating Temperature: 155°C; Tolerance: 1%; Case/Package: 0603; RoHS Compliant: True
TR1 = CMP-009-00358-1: Cermet trimmer potentiometer, 12 turns, 5 kΩ, 0.25 W, THT, on top, 3266W-1-502LF; Color: Blue; Number of Turns: 12; Lead Diameter: 460µm; Lead Length: 4.88mm; Tolerance: 10%; Pitch: 2.54mm; Temperature Coefficient: 100ppm/°C; Power Dissipation: 250mW; REACH SVHC: No; Number of Terminals: 3; Min Operating Temperature: -55°C; Height: 7.24mm; Termination: Pin; Case/Package: Radial; Mounting Technology: PCB, Through Hole; Depth: 4.5mm; Voltage Rating (DC): 300V; Contact Plating: Tin; Pins: 3; Working Voltage: 300V; Type: Potentiometer; Radiation Hardening: No; Composition: Cermet, Potentiometer; Max Operating Temperature: 125°C; Power Rating: 250mW; Width: 4.5mm; Lifecycle Status: Production; Max Power Dissipation: 250mW; Weight: 425mg; Schedule B: 8533400080, 8533400080; RoHS: Compliant; Length: 6.71mm; Taper: Linear; Military Standard: Not
U1 = CMP-019-00098-2: DC-DC Switching Boost (Step Up) Regulator, Adjustable, 2 V-16.5 Vin, 2V-12Vout, 2Aout, SOIC-8; Manufacturer Lifecycle Status: PRODUCTION; Evaluation Kit: Yes; Number of Outputs: 1; Frequency: 300kHz; Output Current: 2A; Output Voltage: 2V; Schedule B: 8542310000; Lead Free: Lead Free; RoHS: Compliant; Number of Channels: 1; Pins: 8; Min Operating Temperature: 0°C; Max Operating Temperature: 70°C; Lifecycle Status: Production; Packaging: Cut Tape
U2 = CMP-00399-1: Comparator Single R-R I/O 5.5V 5-Pin SOT-23 T/R Automotive AEC-Q100; Output Type: Push-Pull; Number of Elements: 1; Output Current per Channel: 2mA; Common Mode Rejection Ratio: 70dB; Response Time: 4µs; Max Input Current: 1pA; Max Supply Current: 1mA; Propagation Delay: 8µs; Quiescent Current: 1µA; Min Supply Voltage: 1.6V; Input Offset Voltage (Vos): 7mV; Hysteresis: 6.5mV; Power Supply Rejection Ratio (PSRR): 80dB; Natural Thermal Resistance: 256°C/W; Lifecycle Status: Production; Schedule B: 8542330000, 8542330000; Contact Plating: Tin; Country of Origin: Thailand; Max Supply Voltage: 5.5V; Length: 3.1mm; Country of Fabrication: United States of America; Output Current: 2mA; Width: 1.8mm; Case/Package: SOT-23; Lead Free: Lead Free; Nominal Supply Current: 1mA; RoHS Compliant: Yes; Input Bias Current: 1pA; Country of Assembly: Thailand; Height: 1.3mm; Channels: 1; Number of Channels: 1; Harmonized Tariff Schedule (HTS) Code: 8542.33.0001; Min Operating Temperature: -40°C; Export Control Classification Number (ECCN) Code: EAR99; Mounting Technology: Surface Mount; Pins: 5; Radiation Hardening: No; Max Operating Temperature: 85°C; Projected EOL Date: 2034-03-14; Introduction Date: 2003-03-14; Type: General Purpose; RoHS: Compliant

## Nets that join several sheets
+3V3: Nixie Valve Clock Power Supply Daughterboard (8 pins), POWER (C14.1 U3.3), HV (C15.1 R1.2 U2.2)
+9V: POWER (C13.1 D3.2 J3.1 U3.1), HV (Q4.1,2,3 R8.2)
+100V: Nixie Valve Clock Power Supply Daughterboard (8 pins), HV (D2.1 R13.2)
+HV: Nixie Valve Clock Power Supply Daughterboard (8 pins), HV (Q2.2 Q2.4 R5.2 R13.1)
GND: Nixie Valve Clock Power Supply Daughterboard (52 pins), POWER (7 pins), HV (25 pins)
!HV_SHDN: Nixie Valve Clock Power Supply Daughterboard (J1.33 J1.34), HV (R15.2)
FAULT: Nixie Valve Clock Power Supply Daughterboard (J1.37 J1.38), HV (U2.1)

## Assembly variants
Various DNF Variant of Nixie Valve Clock Power Supply Daughterboard: not fitted C9